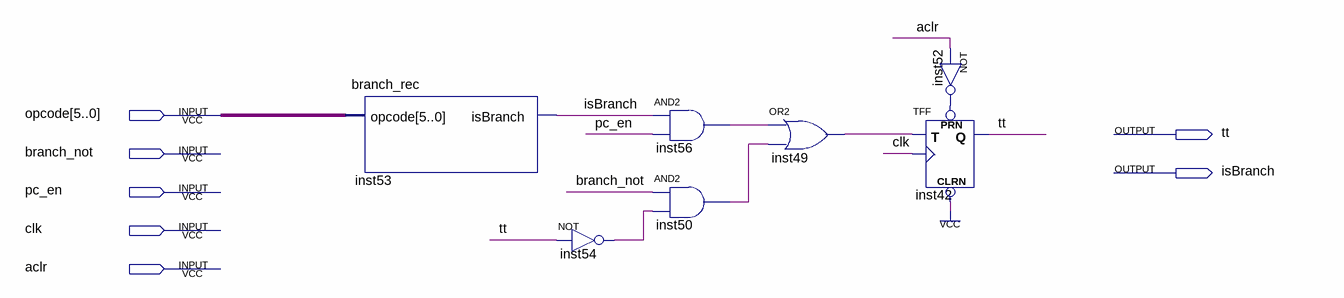
[diagram p0: schematic sheet]
// Quartus schematic BranchComp.bdf as structural Verilog: 7 symbols, 7 pins
module BranchComp (
  input  [5:0] opcode,
  input  branch_not,
  input  pc_en,
  input  clk,
  input  aclr,
  output tt,
  output isBranch
);

  wire inst49_out, inst50_out, inst52_out, inst54_out, inst56_out;

  branch_rec inst53 (.opcode(opcode), .isBranch(isBranch));
  not inst54 (inst54_out, tt);
  and inst56 (inst56_out, isBranch, pc_en);
  and inst50 (inst50_out, branch_not, inst54_out);
  or inst49 (inst49_out, inst56_out, inst50_out);
  not inst52 (inst52_out, aclr);
  TFF inst42 (.PRN(inst52_out), .CLRN(1'b1), .T(inst49_out), .CLK(clk), .Q(tt));
endmodule
